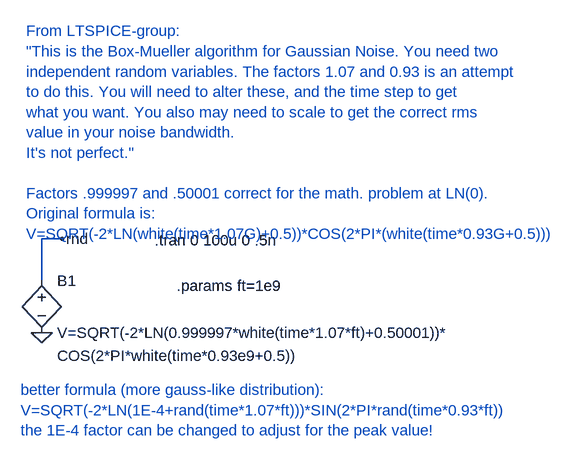
[diagram p0: schematic box_mueller_gauss_noise.asc]
box_mueller_gauss_noise.asc, the LTspice schematic file:
Version 4
SHEET 1 1060 680
WIRE 0 224 0 160
WIRE 0 160 32 160
FLAG 0 304 0
FLAG 32 160 rnd
SYMBOL bv 0 208 R0
WINDOW 123 24 132 Left 0
SYMATTR Value2 COS(2*PI*white(time*0.93e9+0.5))
SYMATTR InstName B1
SYMATTR Value V=SQRT(-2*LN(0.999997*white(time*1.07*ft)+0.50001))*
TEXT 174 162 Left 0 !.tran 0 100u 0 .5n
TEXT -24 -160 Left 0 ;From LTSPICE-group:\n"This is the Box-Mueller algorithm for Gaussian Noise. You need two\nindependent random variables. The factors 1.07 and 0.93 is an attempt\nto do this. You will need to alter these, and the time step to get\nwhat you want. You also may need to scale to get the correct rms\nvalue in your noise bandwidth.\nIt's not perfect."\n \nFactors .999997 and .50001 correct for the math. problem at LN(0).\nOriginal formula is:\nV=SQRT(-2*LN(white(time*1.07G)+0.5))*COS(2*PI*(white(time*0.93G+0.5)))
TEXT 208 232 Left 0 !.params ft=1e9
TEXT -32 392 Left 0 ;better formula (more gauss-like distribution):\nV=SQRT(-2*LN(1E-4+rand(time*1.07*ft)))*SIN(2*PI*rand(time*0.93*ft))\nthe 1E-4 factor can be changed to adjust for the peak value!

The netlist it stands for:
* box_mueller_gauss_noise.asc
B1 rnd 0 V=SQRT(-2*LN(0.999997*white(time*1.07*ft)+0.50001))* COS(2*PI*white(time*0.93e9+0.5))
.tran 0 100u 0 .5n
* From LTSPICE-group:
* "This is the Box-Mueller algorithm for Gaussian Noise. You need two
* independent random variables. The factors 1.07 and 0.93 is an attempt
* to do this. You will need to alter these, and the time step to get
* what you want. You also may need to scale to get the correct rms
* value in your noise bandwidth.
* It's not perfect."
* Factors .999997 and .50001 correct for the math. problem at LN(0).
* Original formula is:
* V=SQRT(-2*LN(white(time*1.07G)+0.5))*COS(2*PI*(white(time*0.93G+0.5)))
.params ft=1e9
* better formula (more gauss-like distribution):
* V=SQRT(-2*LN(1E-4+rand(time*1.07*ft)))*SIN(2*PI*rand(time*0.93*ft))
* the 1E-4 factor can be changed to adjust for the peak value!
.backanno
.end